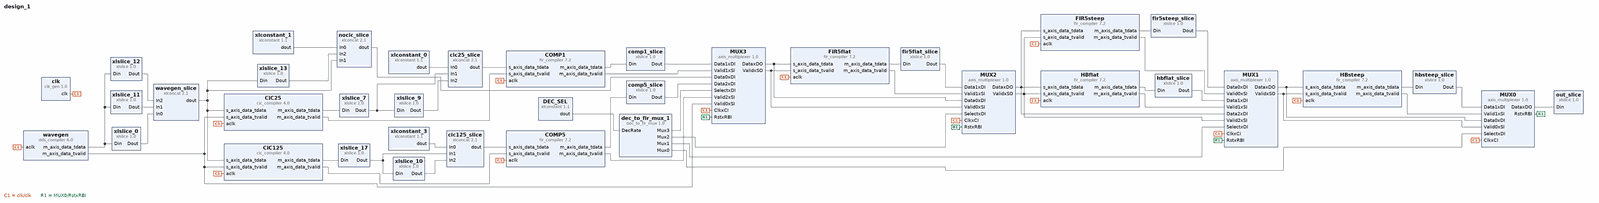
[diagram p0: block diagram of the top level, whole]
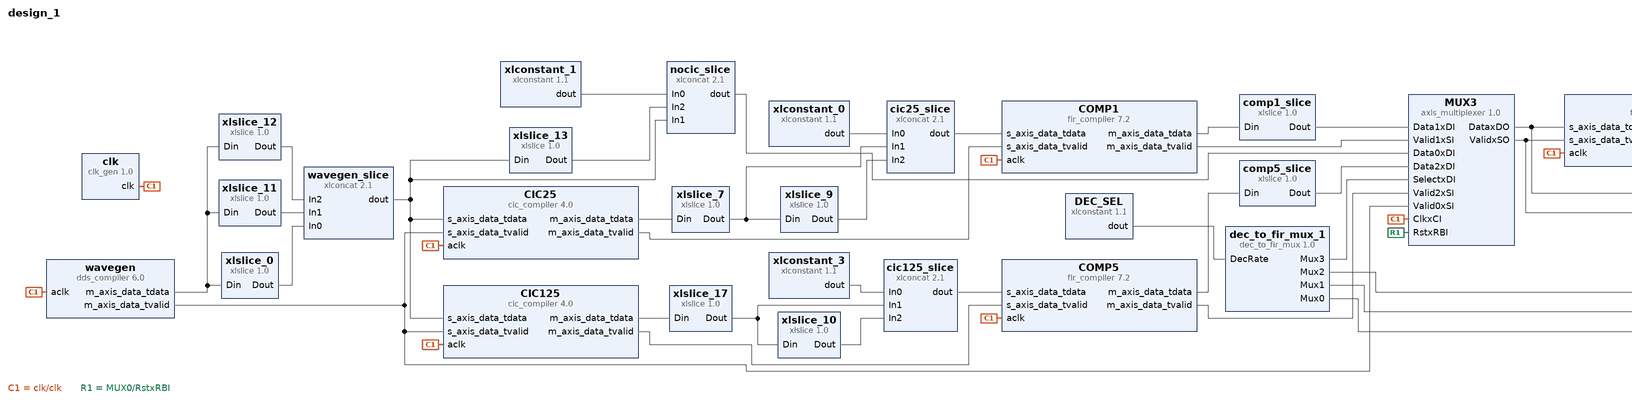
[diagram p1: block diagram of the top level, left part]
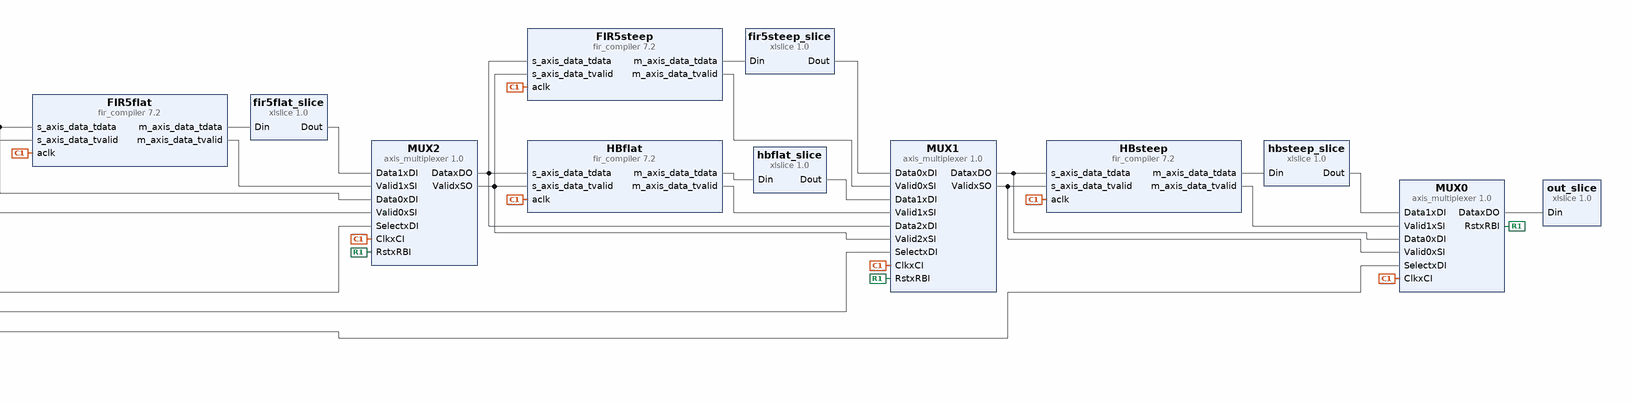
[diagram p2: block diagram of the top level, right part]
# Vivado block design design_1, Vivado 2016.2
create_bd_design design_1

create_bd_cell -type ip -vlnv xilinx.com:ip:clk_gen:1.0 clk
set_property -dict {CONFIG.FREQ_HZ 125000000} [get_bd_cells clk]
create_bd_cell -type ip -vlnv xilinx.com:ip:dds_compiler:6.0 wavegen
set_property -dict [list \
  CONFIG.DDS_Clock_Rate 125 \
  CONFIG.Frequency_Resolution 0.4 \
  CONFIG.Noise_Shaping Auto \
  CONFIG.Phase_Width 29 \
  CONFIG.Output_Width 8 \
  CONFIG.Output_Frequency1 0.021 \
  CONFIG.PINC1 10110000001010010 \
] [get_bd_cells wavegen]
create_bd_cell -type ip -vlnv xilinx.com:ip:xlslice:1.0 xlslice_0
set_property -dict {CONFIG.DOUT_WIDTH 14 CONFIG.DIN_TO 2 CONFIG.DIN_FROM 15 CONFIG.DIN_WIDTH 16} [get_bd_cells xlslice_0]
create_bd_cell -type ip -vlnv xilinx.com:ip:xlconcat:2.1 wavegen_slice
set_property -dict {CONFIG.NUM_PORTS 3 CONFIG.IN0_WIDTH 14 CONFIG.IN1_WIDTH 1 CONFIG.IN2_WIDTH 1} [get_bd_cells wavegen_slice]
create_bd_cell -type ip -vlnv xilinx.com:ip:fir_compiler:7.2 FIR5flat
set_property -dict [list \
  CONFIG.CoefficientSource COE_File \
  CONFIG.Coefficient_File ../../../../../../../pitaya/firmware/fpga/p_chain5/coefData/dec5flat.coe \
  CONFIG.Coefficient_Sets 1 \
  CONFIG.Filter_Type Decimation \
  CONFIG.Interpolation_Rate 1 \
  CONFIG.Decimation_Rate 5 \
  CONFIG.Zero_Pack_Factor 1 \
  CONFIG.Number_Channels 1 \
  CONFIG.RateSpecification Frequency_Specification \
  CONFIG.Sample_Frequency 125 \
  CONFIG.Clock_Frequency 125 \
  CONFIG.Coefficient_Sign Signed \
  CONFIG.Quantization Quantize_Only \
  CONFIG.Coefficient_Width 16 \
  CONFIG.Coefficient_Fractional_Bits 17 \
  CONFIG.Coefficient_Structure Inferred \
  CONFIG.Data_Width 24 \
  CONFIG.Data_Fractional_Bits 7 \
  CONFIG.Output_Rounding_Mode Truncate_LSBs \
  CONFIG.Output_Width 32 \
  CONFIG.Filter_Architecture Systolic_Multiply_Accumulate \
  CONFIG.ColumnConfig 7 \
] [get_bd_cells FIR5flat]
create_bd_cell -type ip -vlnv xilinx.com:ip:xlslice:1.0 fir5steep_slice
set_property -dict {CONFIG.DOUT_WIDTH 24 CONFIG.DIN_TO 6 CONFIG.DIN_FROM 29 CONFIG.DIN_WIDTH 32} [get_bd_cells fir5steep_slice]
create_bd_cell -type ip -vlnv xilinx.com:ip:xlslice:1.0 fir5flat_slice
set_property -dict {CONFIG.DOUT_WIDTH 24 CONFIG.DIN_TO 7 CONFIG.DIN_FROM 30 CONFIG.DIN_WIDTH 32} [get_bd_cells fir5flat_slice]
create_bd_cell -type ip -vlnv xilinx.com:ip:fir_compiler:7.2 FIR5steep
set_property -dict [list \
  CONFIG.CoefficientSource COE_File \
  CONFIG.Coefficient_File ../../../../../../../pitaya/firmware/fpga/p_chain5/coefData/dec5steep.coe \
  CONFIG.Coefficient_Sets 1 \
  CONFIG.Filter_Type Decimation \
  CONFIG.Interpolation_Rate 1 \
  CONFIG.Decimation_Rate 5 \
  CONFIG.Zero_Pack_Factor 1 \
  CONFIG.Number_Channels 1 \
  CONFIG.RateSpecification Frequency_Specification \
  CONFIG.Sample_Frequency 125 \
  CONFIG.Clock_Frequency 125 \
  CONFIG.Coefficient_Sign Signed \
  CONFIG.Quantization Quantize_Only \
  CONFIG.Coefficient_Width 16 \
  CONFIG.BestPrecision false \
  CONFIG.Coefficient_Fractional_Bits 17 \
  CONFIG.Coefficient_Structure Inferred \
  CONFIG.Data_Width 24 \
  CONFIG.Data_Fractional_Bits 7 \
  CONFIG.Output_Rounding_Mode Truncate_LSBs \
  CONFIG.Output_Width 32 \
  CONFIG.Filter_Architecture Systolic_Multiply_Accumulate \
  CONFIG.ColumnConfig 21 \
] [get_bd_cells FIR5steep]
create_bd_cell -type ip -vlnv xilinx.com:ip:cic_compiler:4.0 CIC25
set_property -dict [list \
  CONFIG.Filter_Type Decimation \
  CONFIG.Number_Of_Stages 4 \
  CONFIG.Fixed_Or_Initial_Rate 25 \
  CONFIG.Minimum_Rate 25 \
  CONFIG.Maximum_Rate 25 \
  CONFIG.Input_Sample_Frequency 125 \
  CONFIG.Clock_Frequency 125 \
  CONFIG.SamplePeriod 1 \
  CONFIG.Input_Data_Width 14 \
  CONFIG.Output_Data_Width 33 \
] [get_bd_cells CIC25]
create_bd_cell -type ip -vlnv xilinx.com:ip:xlslice:1.0 xlslice_7
set_property -dict {CONFIG.DOUT_WIDTH 16 CONFIG.DIN_TO 17 CONFIG.DIN_FROM 32 CONFIG.DIN_WIDTH 40} [get_bd_cells xlslice_7]
create_bd_cell -type ip -vlnv xilinx.com:ip:fir_compiler:7.2 COMP1
set_property -dict [list \
  CONFIG.CoefficientSource COE_File \
  CONFIG.Coefficient_File ../../../../../../../pitaya/firmware/fpga/p_chain5/coefData/comp025.coe \
  CONFIG.Coefficient_Sets 1 \
  CONFIG.Filter_Type Single_Rate \
  CONFIG.Interpolation_Rate 1 \
  CONFIG.Decimation_Rate 1 \
  CONFIG.Zero_Pack_Factor 1 \
  CONFIG.Number_Channels 1 \
  CONFIG.RateSpecification Frequency_Specification \
  CONFIG.Sample_Frequency 5 \
  CONFIG.Clock_Frequency 125 \
  CONFIG.Coefficient_Sign Signed \
  CONFIG.Quantization Quantize_Only \
  CONFIG.Coefficient_Width 16 \
  CONFIG.Coefficient_Fractional_Bits 16 \
  CONFIG.Coefficient_Structure Inferred \
  CONFIG.Data_Width 24 \
  CONFIG.Data_Fractional_Bits 7 \
  CONFIG.Output_Rounding_Mode Truncate_LSBs \
  CONFIG.Output_Width 32 \
  CONFIG.Filter_Architecture Systolic_Multiply_Accumulate \
  CONFIG.ColumnConfig 1 \
] [get_bd_cells COMP1]
create_bd_cell -type ip -vlnv xilinx.com:ip:xlslice:1.0 comp1_slice
set_property -dict {CONFIG.DOUT_WIDTH 24 CONFIG.DIN_TO 7 CONFIG.DIN_FROM 30 CONFIG.DIN_WIDTH 32} [get_bd_cells comp1_slice]
create_bd_cell -type ip -vlnv xilinx.com:ip:xlconcat:2.1 cic25_slice
set_property -dict {CONFIG.NUM_PORTS 3 CONFIG.IN0_WIDTH 7 CONFIG.IN1_WIDTH 16 CONFIG.IN2_WIDTH 1} [get_bd_cells cic25_slice]
create_bd_cell -type ip -vlnv xilinx.com:ip:xlconstant:1.1 xlconstant_0
set_property -dict {CONFIG.CONST_WIDTH 7 CONFIG.CONST_VAL 0} [get_bd_cells xlconstant_0]
create_bd_cell -type ip -vlnv xilinx.com:ip:xlslice:1.0 xlslice_9
set_property -dict {CONFIG.DOUT_WIDTH 1 CONFIG.DIN_TO 15 CONFIG.DIN_FROM 15 CONFIG.DIN_WIDTH 16} [get_bd_cells xlslice_9]
create_bd_cell -type ip -vlnv xilinx.com:ip:xlconcat:2.1 nocic_slice
set_property -dict {CONFIG.NUM_PORTS 3 CONFIG.IN0_WIDTH 7 CONFIG.IN1_WIDTH 16 CONFIG.IN2_WIDTH 1} [get_bd_cells nocic_slice]
create_bd_cell -type ip -vlnv xilinx.com:ip:xlconstant:1.1 xlconstant_1
set_property -dict {CONFIG.CONST_WIDTH 7 CONFIG.CONST_VAL 0} [get_bd_cells xlconstant_1]
create_bd_cell -type ip -vlnv xilinx.com:ip:xlslice:1.0 xlslice_13
set_property -dict {CONFIG.DOUT_WIDTH 1 CONFIG.DIN_TO 15 CONFIG.DIN_FROM 15 CONFIG.DIN_WIDTH 16} [get_bd_cells xlslice_13]
create_bd_cell -type ip -vlnv xilinx.com:ip:cic_compiler:4.0 CIC125
set_property -dict [list \
  CONFIG.Filter_Type Decimation \
  CONFIG.Number_Of_Stages 4 \
  CONFIG.Fixed_Or_Initial_Rate 125 \
  CONFIG.Minimum_Rate 125 \
  CONFIG.Maximum_Rate 125 \
  CONFIG.Input_Sample_Frequency 125 \
  CONFIG.Clock_Frequency 125 \
  CONFIG.SamplePeriod 1 \
  CONFIG.Input_Data_Width 14 \
  CONFIG.Output_Data_Width 42 \
] [get_bd_cells CIC125]
create_bd_cell -type ip -vlnv xilinx.com:ip:fir_compiler:7.2 COMP5
set_property -dict [list \
  CONFIG.CoefficientSource COE_File \
  CONFIG.Coefficient_File ../../../../../../../pitaya/firmware/fpga/p_chain5/coefData/comp125.coe \
  CONFIG.Coefficient_Sets 1 \
  CONFIG.Filter_Type Decimation \
  CONFIG.Interpolation_Rate 1 \
  CONFIG.Decimation_Rate 5 \
  CONFIG.Zero_Pack_Factor 1 \
  CONFIG.Number_Channels 1 \
  CONFIG.RateSpecification Frequency_Specification \
  CONFIG.Sample_Frequency 1 \
  CONFIG.Clock_Frequency 125 \
  CONFIG.Coefficient_Sign Signed \
  CONFIG.Quantization Quantize_Only \
  CONFIG.Coefficient_Width 16 \
  CONFIG.Coefficient_Fractional_Bits 16 \
  CONFIG.Coefficient_Structure Inferred \
  CONFIG.Data_Width 24 \
  CONFIG.Data_Fractional_Bits 7 \
  CONFIG.Output_Rounding_Mode Truncate_LSBs \
  CONFIG.Output_Width 32 \
  CONFIG.Filter_Architecture Systolic_Multiply_Accumulate \
  CONFIG.ColumnConfig 1 \
] [get_bd_cells COMP5]
create_bd_cell -type ip -vlnv xilinx.com:ip:fir_compiler:7.2 HBsteep
set_property -dict [list \
  CONFIG.CoefficientSource COE_File \
  CONFIG.Coefficient_File ../../../../../../../pitaya/firmware/fpga/p_chain5/coefData/halfband.coe \
  CONFIG.Coefficient_Sets 1 \
  CONFIG.Filter_Type Decimation \
  CONFIG.Interpolation_Rate 1 \
  CONFIG.Decimation_Rate 2 \
  CONFIG.Zero_Pack_Factor 1 \
  CONFIG.Number_Channels 1 \
  CONFIG.RateSpecification Frequency_Specification \
  CONFIG.Sample_Frequency 0.5 \
  CONFIG.Clock_Frequency 125 \
  CONFIG.Coefficient_Sign Signed \
  CONFIG.Quantization Quantize_Only \
  CONFIG.Coefficient_Width 16 \
  CONFIG.BestPrecision false \
  CONFIG.Coefficient_Fractional_Bits 15 \
  CONFIG.Coefficient_Structure Inferred \
  CONFIG.Data_Width 24 \
  CONFIG.Data_Fractional_Bits 7 \
  CONFIG.Output_Rounding_Mode Truncate_LSBs \
  CONFIG.Output_Width 32 \
  CONFIG.Filter_Architecture Systolic_Multiply_Accumulate \
  CONFIG.ColumnConfig 1 \
] [get_bd_cells HBsteep]
create_bd_cell -type ip -vlnv xilinx.com:ip:xlslice:1.0 hbsteep_slice
set_property -dict {CONFIG.DOUT_WIDTH 24 CONFIG.DIN_TO 7 CONFIG.DIN_FROM 30 CONFIG.DIN_WIDTH 32} [get_bd_cells hbsteep_slice]
create_bd_cell -type ip -vlnv xilinx.com:ip:xlslice:1.0 comp5_slice
set_property -dict {CONFIG.DOUT_WIDTH 24 CONFIG.DIN_TO 7 CONFIG.DIN_FROM 30 CONFIG.DIN_WIDTH 32} [get_bd_cells comp5_slice]
create_bd_cell -type ip -vlnv xilinx.com:ip:xlconcat:2.1 cic125_slice
set_property -dict {CONFIG.NUM_PORTS 3 CONFIG.IN0_WIDTH 7 CONFIG.IN1_WIDTH 16 CONFIG.IN2_WIDTH 1} [get_bd_cells cic125_slice]
create_bd_cell -type ip -vlnv xilinx.com:ip:xlconstant:1.1 xlconstant_3
set_property -dict {CONFIG.CONST_WIDTH 7 CONFIG.CONST_VAL 0} [get_bd_cells xlconstant_3]
create_bd_cell -type ip -vlnv xilinx.com:ip:xlslice:1.0 xlslice_10
set_property -dict {CONFIG.DOUT_WIDTH 1 CONFIG.DIN_TO 15 CONFIG.DIN_FROM 15 CONFIG.DIN_WIDTH 16} [get_bd_cells xlslice_10]
create_bd_cell -type ip -vlnv xilinx.com:ip:xlslice:1.0 xlslice_17
set_property -dict {CONFIG.DOUT_WIDTH 16 CONFIG.DIN_TO 27 CONFIG.DIN_FROM 42 CONFIG.DIN_WIDTH 48} [get_bd_cells xlslice_17]
create_bd_cell -type ip -vlnv raphael-frey:user:axis_multiplexer:1.0 MUX3
set_property -dict {CONFIG.C_AXIS_TDATA_WIDTH 24 CONFIG.C_AXIS_NUM_SI_SLOTS 3} [get_bd_cells MUX3]
create_bd_cell -type ip -vlnv raphael-frey:user:axis_multiplexer:1.0 MUX0
set_property -dict {CONFIG.C_AXIS_TDATA_WIDTH 24} [get_bd_cells MUX0]
create_bd_cell -type ip -vlnv raphael-frey:user:axis_multiplexer:1.0 MUX1
set_property -dict {CONFIG.C_AXIS_TDATA_WIDTH 24 CONFIG.C_AXIS_NUM_SI_SLOTS 3} [get_bd_cells MUX1]
create_bd_cell -type ip -vlnv raphael-frey:user:axis_multiplexer:1.0 MUX2
set_property -dict {CONFIG.C_AXIS_TDATA_WIDTH 24} [get_bd_cells MUX2]
create_bd_cell -type ip -vlnv xilinx.com:ip:fir_compiler:7.2 HBflat
set_property -dict [list \
  CONFIG.CoefficientSource COE_File \
  CONFIG.Coefficient_File ../../../../../../../pitaya/firmware/fpga/p_chain5/coefData/halfband.coe \
  CONFIG.Coefficient_Sets 1 \
  CONFIG.Filter_Type Decimation \
  CONFIG.Interpolation_Rate 1 \
  CONFIG.Decimation_Rate 2 \
  CONFIG.Zero_Pack_Factor 1 \
  CONFIG.Number_Channels 1 \
  CONFIG.RateSpecification Frequency_Specification \
  CONFIG.Sample_Frequency 0.5 \
  CONFIG.Clock_Frequency 125 \
  CONFIG.Coefficient_Sign Signed \
  CONFIG.Quantization Quantize_Only \
  CONFIG.Coefficient_Width 16 \
  CONFIG.BestPrecision false \
  CONFIG.Coefficient_Fractional_Bits 15 \
  CONFIG.Coefficient_Structure Inferred \
  CONFIG.Data_Width 24 \
  CONFIG.Data_Fractional_Bits 7 \
  CONFIG.Output_Rounding_Mode Truncate_LSBs \
  CONFIG.Output_Width 32 \
  CONFIG.Filter_Architecture Systolic_Multiply_Accumulate \
  CONFIG.ColumnConfig 1 \
] [get_bd_cells HBflat]
create_bd_cell -type ip -vlnv xilinx.com:ip:xlslice:1.0 xlslice_11
set_property -dict {CONFIG.DOUT_WIDTH 1 CONFIG.DIN_TO 15 CONFIG.DIN_FROM 15 CONFIG.DIN_WIDTH 16} [get_bd_cells xlslice_11]
create_bd_cell -type ip -vlnv xilinx.com:ip:xlslice:1.0 xlslice_12
set_property -dict {CONFIG.DOUT_WIDTH 1 CONFIG.DIN_TO 15 CONFIG.DIN_FROM 15 CONFIG.DIN_WIDTH 16} [get_bd_cells xlslice_12]
create_bd_cell -type ip -vlnv xilinx.com:ip:xlslice:1.0 out_slice
set_property -dict {CONFIG.DOUT_WIDTH 16 CONFIG.DIN_TO 7 CONFIG.DIN_FROM 22 CONFIG.DIN_WIDTH 24} [get_bd_cells out_slice]
create_bd_cell -type ip -vlnv xilinx.com:ip:xlslice:1.0 hbflat_slice
set_property -dict {CONFIG.DOUT_WIDTH 24 CONFIG.DIN_TO 6 CONFIG.DIN_FROM 29 CONFIG.DIN_WIDTH 32} [get_bd_cells hbflat_slice]
create_bd_cell -type ip -vlnv xilinx.com:ip:xlconstant:1.1 DEC_SEL
set_property -dict {CONFIG.CONST_WIDTH 32 CONFIG.CONST_VAL 2500} [get_bd_cells DEC_SEL]
create_bd_cell -type ip -vlnv noah-huesser:user:dec_to_fir_mux:1.0 dec_to_fir_mux_1

# ---- connections ----

connect_bd_net [get_bd_pins clk/clk] \
  [get_bd_pins wavegen/aclk] [get_bd_pins FIR5flat/aclk] [get_bd_pins FIR5steep/aclk] [get_bd_pins CIC25/aclk] \
  [get_bd_pins COMP1/aclk] [get_bd_pins CIC125/aclk] [get_bd_pins COMP5/aclk] [get_bd_pins HBsteep/aclk] \
  [get_bd_pins MUX2/ClkxCI] [get_bd_pins HBflat/aclk] [get_bd_pins MUX1/ClkxCI] [get_bd_pins MUX0/ClkxCI] \
  [get_bd_pins MUX3/ClkxCI]
connect_bd_net -net FIR_resized1_m_axis_data_tdata [get_bd_pins FIR5flat/m_axis_data_tdata] [get_bd_pins fir5flat_slice/Din]
connect_bd_net -net FIR_resized2_m_axis_data_tdata [get_bd_pins FIR5steep/m_axis_data_tdata] [get_bd_pins fir5steep_slice/Din]
connect_bd_net -net cic_compiler_0_m_axis_data_tdata [get_bd_pins CIC25/m_axis_data_tdata] [get_bd_pins xlslice_7/Din]
connect_bd_net -net FIR_resized3_m_axis_data_tdata [get_bd_pins COMP1/m_axis_data_tdata] [get_bd_pins comp1_slice/Din]
connect_bd_net [get_bd_pins xlslice_7/Dout] [get_bd_pins cic25_slice/In1] [get_bd_pins xlslice_9/Din]
connect_bd_net [get_bd_pins xlconstant_0/dout] [get_bd_pins cic25_slice/In0]
connect_bd_net [get_bd_pins xlslice_9/Dout] [get_bd_pins cic25_slice/In2]
connect_bd_net [get_bd_pins xlconstant_1/dout] [get_bd_pins nocic_slice/In0]
connect_bd_net [get_bd_pins xlslice_13/Dout] [get_bd_pins nocic_slice/In2]
connect_bd_net [get_bd_pins wavegen/m_axis_data_tdata] [get_bd_pins xlslice_0/Din] [get_bd_pins xlslice_11/Din] [get_bd_pins xlslice_12/Din]
connect_bd_net -net xlconcat_0_dout [get_bd_pins wavegen_slice/dout] \
  [get_bd_pins CIC25/s_axis_data_tdata] [get_bd_pins nocic_slice/In1] [get_bd_pins xlslice_13/Din] \
  [get_bd_pins CIC125/s_axis_data_tdata]
connect_bd_net [get_bd_pins wavegen/m_axis_data_tvalid] \
  [get_bd_pins CIC25/s_axis_data_tvalid] [get_bd_pins CIC125/s_axis_data_tvalid] [get_bd_pins MUX3/Valid0xSI]
connect_bd_net -net FIR_resized6_m_axis_data_tdata [get_bd_pins COMP5/m_axis_data_tdata] [get_bd_pins comp5_slice/Din]
connect_bd_net -net FIR_resized7_m_axis_data_tdata [get_bd_pins HBsteep/m_axis_data_tdata] [get_bd_pins hbsteep_slice/Din]
connect_bd_net -net cic_compiler_1_m_axis_data_tdata [get_bd_pins CIC125/m_axis_data_tdata] [get_bd_pins xlslice_17/Din]
connect_bd_net [get_bd_pins xlslice_17/Dout] [get_bd_pins cic125_slice/In1] [get_bd_pins xlslice_10/Din]
connect_bd_net [get_bd_pins xlconstant_3/dout] [get_bd_pins cic125_slice/In0]
connect_bd_net [get_bd_pins xlslice_10/Dout] [get_bd_pins cic125_slice/In2]
connect_bd_net [get_bd_pins COMP5/m_axis_data_tvalid] [get_bd_pins MUX3/Valid2xSI]
connect_bd_net -net xlslice_15_Dout [get_bd_pins comp5_slice/Dout] [get_bd_pins MUX3/Data2xDI]
connect_bd_net [get_bd_pins COMP1/m_axis_data_tvalid] [get_bd_pins MUX3/Valid1xSI]
connect_bd_net -net xlslice_8_Dout [get_bd_pins comp1_slice/Dout] [get_bd_pins MUX3/Data1xDI]
connect_bd_net [get_bd_pins MUX3/DataxDO] [get_bd_pins FIR5flat/s_axis_data_tdata] [get_bd_pins MUX2/Data0xDI]
connect_bd_net [get_bd_pins MUX3/ValidxSO] [get_bd_pins FIR5flat/s_axis_data_tvalid] [get_bd_pins MUX2/Valid0xSI]
connect_bd_net -net xlslice_6_Dout [get_bd_pins fir5flat_slice/Dout] [get_bd_pins MUX2/Data1xDI]
connect_bd_net [get_bd_pins FIR5flat/m_axis_data_tvalid] [get_bd_pins MUX2/Valid1xSI]
connect_bd_net [get_bd_pins MUX2/DataxDO] [get_bd_pins FIR5steep/s_axis_data_tdata] [get_bd_pins MUX1/Data2xDI] [get_bd_pins HBflat/s_axis_data_tdata]
connect_bd_net [get_bd_pins MUX2/ValidxSO] \
  [get_bd_pins FIR5steep/s_axis_data_tvalid] [get_bd_pins MUX1/Valid2xSI] [get_bd_pins HBflat/s_axis_data_tvalid]
connect_bd_net -net xlslice_4_Dout [get_bd_pins fir5steep_slice/Dout] [get_bd_pins MUX1/Data0xDI]
connect_bd_net [get_bd_pins FIR5steep/m_axis_data_tvalid] [get_bd_pins MUX1/Valid0xSI]
connect_bd_net [get_bd_pins MUX1/DataxDO] [get_bd_pins MUX0/Data0xDI] [get_bd_pins HBsteep/s_axis_data_tdata]
connect_bd_net [get_bd_pins MUX1/ValidxSO] [get_bd_pins MUX0/Valid0xSI] [get_bd_pins HBsteep/s_axis_data_tvalid]
connect_bd_net -net xlslice_14_Dout [get_bd_pins hbsteep_slice/Dout] [get_bd_pins MUX0/Data1xDI]
connect_bd_net [get_bd_pins HBsteep/m_axis_data_tvalid] [get_bd_pins MUX0/Valid1xSI]
connect_bd_net -net HBsteep1_m_axis_data_tvalid [get_bd_pins HBflat/m_axis_data_tvalid] [get_bd_pins MUX1/Valid1xSI]
connect_bd_net [get_bd_pins MUX0/RstxRBI] [get_bd_pins MUX1/RstxRBI] [get_bd_pins MUX2/RstxRBI] [get_bd_pins MUX3/RstxRBI]
connect_bd_net [get_bd_pins xlslice_0/Dout] [get_bd_pins wavegen_slice/In0]
connect_bd_net [get_bd_pins xlslice_11/Dout] [get_bd_pins wavegen_slice/In1]
connect_bd_net [get_bd_pins xlslice_12/Dout] [get_bd_pins wavegen_slice/In2]
connect_bd_net [get_bd_pins MUX0/DataxDO] [get_bd_pins out_slice/Din]
connect_bd_net -net fir5steep_slice1_Dout [get_bd_pins hbflat_slice/Dout] [get_bd_pins MUX1/Data1xDI]
connect_bd_net -net hbflat_slice_m_axis_data_tdata [get_bd_pins HBflat/m_axis_data_tdata] [get_bd_pins hbflat_slice/Din]
connect_bd_net [get_bd_pins cic25_slice/dout] [get_bd_pins COMP1/s_axis_data_tdata]
connect_bd_net [get_bd_pins CIC25/m_axis_data_tvalid] [get_bd_pins COMP1/s_axis_data_tvalid]
connect_bd_net [get_bd_pins cic125_slice/dout] [get_bd_pins COMP5/s_axis_data_tdata]
connect_bd_net [get_bd_pins CIC125/m_axis_data_tvalid] [get_bd_pins COMP5/s_axis_data_tvalid]
connect_bd_net [get_bd_pins nocic_slice/dout] [get_bd_pins MUX3/Data0xDI]
connect_bd_net [get_bd_pins dec_to_fir_mux_1/Mux3] [get_bd_pins MUX3/SelectxDI]
connect_bd_net [get_bd_pins dec_to_fir_mux_1/Mux2] [get_bd_pins MUX2/SelectxDI]
connect_bd_net [get_bd_pins dec_to_fir_mux_1/Mux1] [get_bd_pins MUX1/SelectxDI]
connect_bd_net [get_bd_pins dec_to_fir_mux_1/Mux0] [get_bd_pins MUX0/SelectxDI]
connect_bd_net [get_bd_pins DEC_SEL/dout] [get_bd_pins dec_to_fir_mux_1/DecRate]

validate_bd_design
save_bd_design
